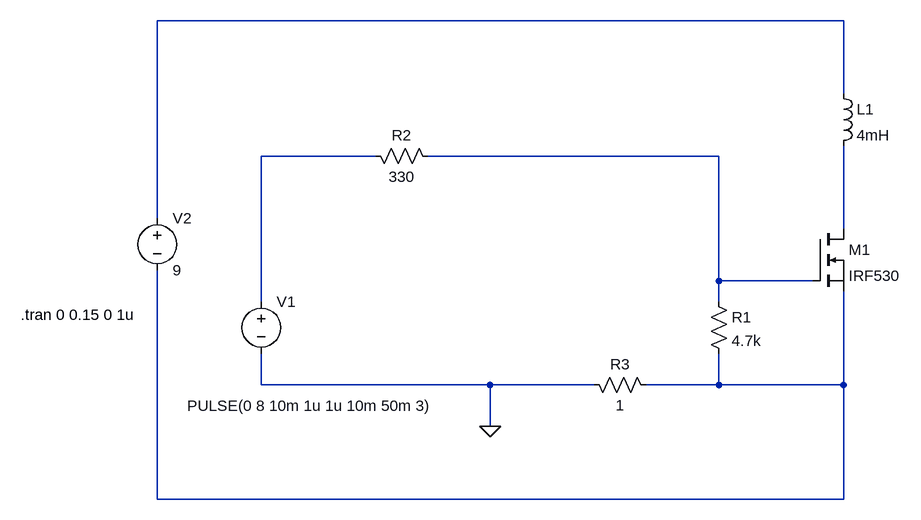
[diagram p0: schematic Solenoid 1.asc]
Solenoid 1.asc, the LTspice schematic file:
Version 4
SHEET 1 880 680
WIRE 768 -160 -288 -160
WIRE 768 -48 768 -160
WIRE 48 48 -128 48
WIRE 576 48 128 48
WIRE -288 144 -288 -160
WIRE 768 160 768 32
WIRE 576 240 576 48
WIRE 720 240 576 240
WIRE -128 272 -128 48
WIRE 576 272 576 240
WIRE -128 400 -128 352
WIRE 224 400 -128 400
WIRE 384 400 224 400
WIRE 576 400 576 352
WIRE 576 400 464 400
WIRE 768 400 768 256
WIRE 768 400 576 400
WIRE 224 464 224 400
WIRE -288 576 -288 224
WIRE 768 576 768 400
WIRE 768 576 -288 576
FLAG 224 464 0
SYMBOL nmos 720 160 R0
SYMATTR InstName M1
SYMATTR Value IRF530
SYMBOL ind 752 -64 R0
SYMATTR InstName L1
SYMATTR Value 4mH
SYMATTR SpiceLine Rser=6
SYMBOL voltage -128 256 R0
WINDOW 3 -114 176 Left 2
WINDOW 123 0 0 Left 2
SYMATTR InstName V1
SYMATTR Value PULSE(0 8 10m 1u 1u 10m 50m 3)
SYMATTR SpiceLine Rser=10
SYMBOL voltage -288 128 R0
WINDOW 123 0 0 Left 2
SYMATTR InstName V2
SYMATTR Value 9
SYMATTR SpiceLine Rser=1
SYMBOL res 560 256 R0
SYMATTR InstName R1
SYMATTR Value 4.7k
SYMBOL res 32 32 M90
WINDOW 0 0 56 VBottom 2
WINDOW 3 32 56 VTop 2
SYMATTR InstName R2
SYMATTR Value 330
SYMBOL res 368 384 M90
WINDOW 0 0 56 VBottom 2
WINDOW 3 32 56 VTop 2
SYMATTR InstName R3
SYMATTR Value 1
TEXT -498 292 Left 2 !.tran 0 0.15 0 1u

The netlist it stands for:
* Solenoid 1.asc
M1 N004 N003 N005 N005 IRF530
L1 N001 N004 4mH Rser=6
V1 N002 0 PULSE(0 8 10m 1u 1u 10m 50m 3) Rser=10
V2 N001 N005 9 Rser=1
R1 N003 N005 4.7k
R2 N002 N003 330
R3 0 N005 1
.model NMOS NMOS
.model PMOS PMOS
.lib standard.mos
.tran 0 0.15 0 1u
.backanno
.end